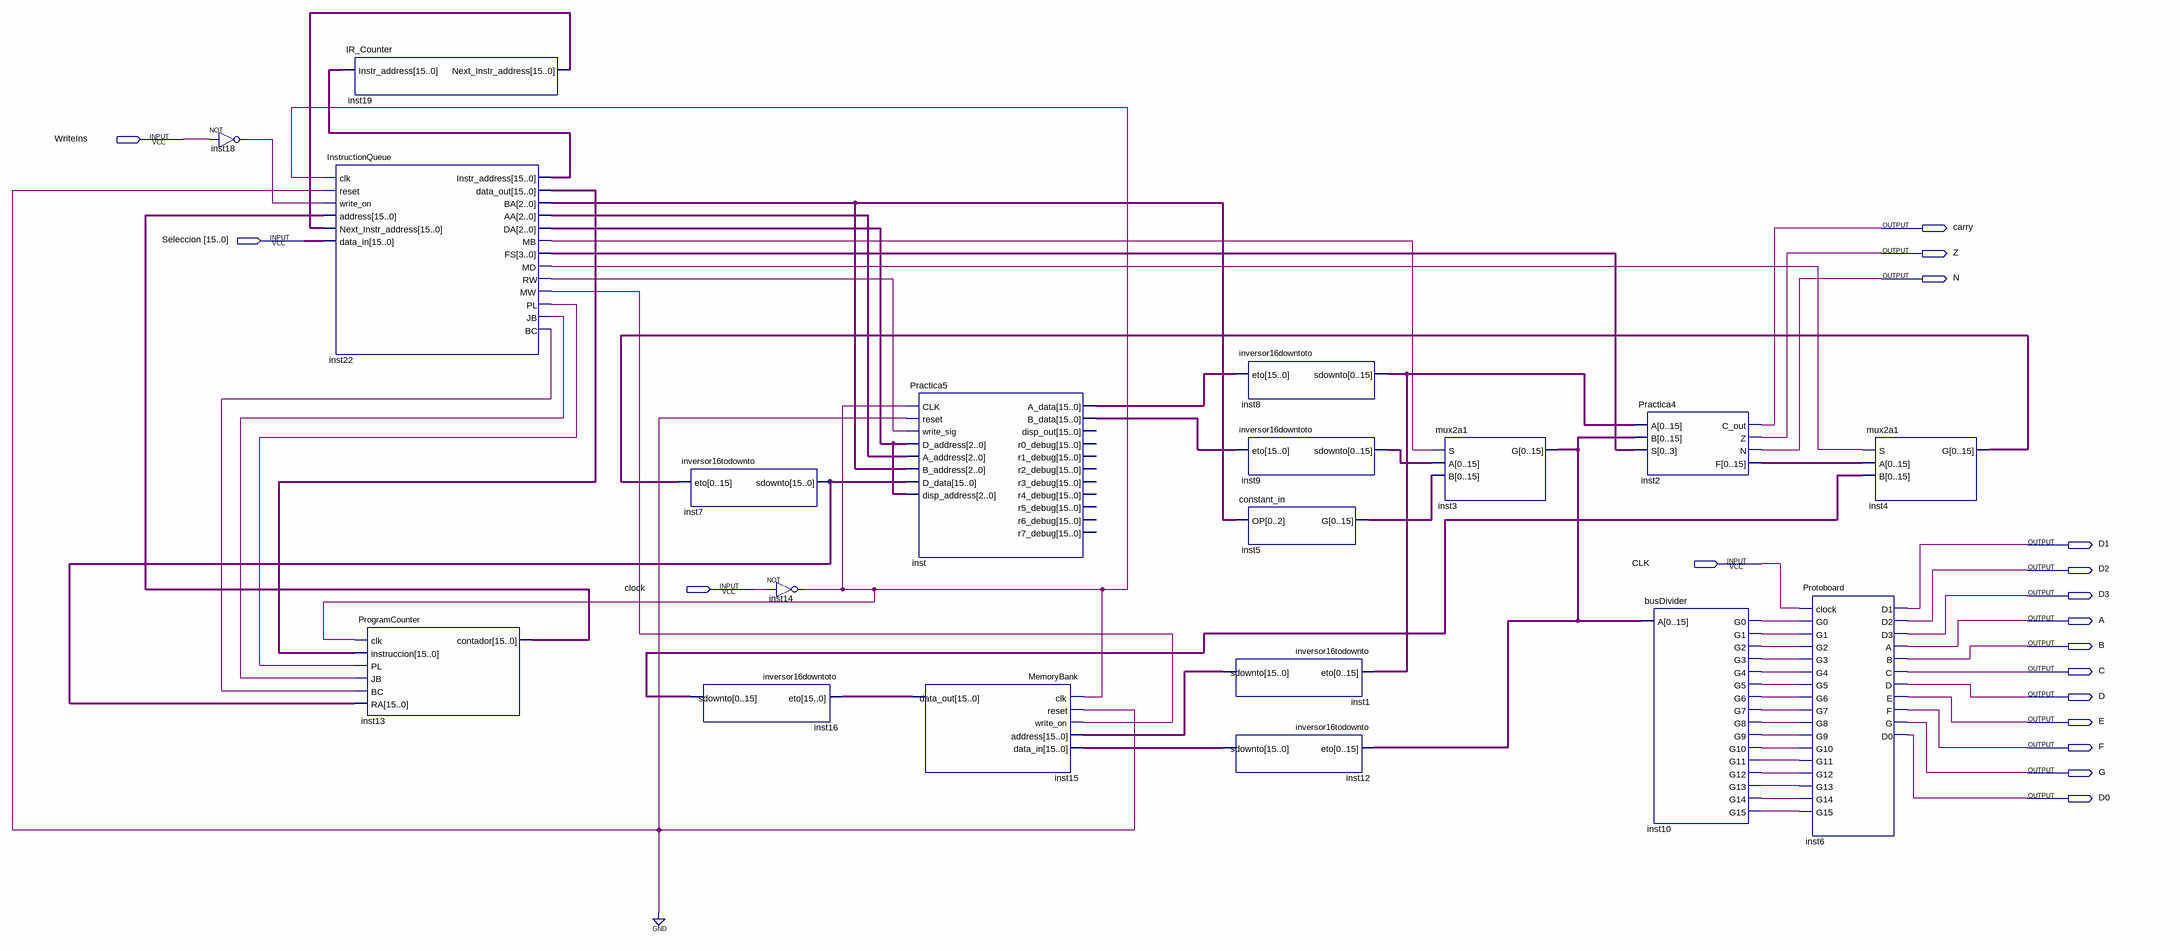
[diagram p0: schematic sheet]
// Quartus schematic CircuitoCompleto.bdf as structural Verilog: 19 symbols, 18 pins
module CircuitoCompleto (
  input  WriteIns,
  input  [15:0] Seleccion,
  input  CLK,
  input  clock,
  output carry,
  output Z,
  output N,
  output D1,
  output D2,
  output D3,
  output A,
  output B,
  output C,
  output D,
  output E,
  output F,
  output G,
  output D0
);

  wire inst10_g0, inst10_g1, inst10_g2, inst10_g3, inst10_g4, inst10_g5, inst10_g6, inst10_g7, inst10_g8,
       inst10_g9, inst10_g10, inst10_g11, inst10_g12, inst10_g13, inst10_g14, inst10_g15, inst14_out,
       inst18_out, inst22_bc, inst22_jb, inst22_mb, inst22_md, inst22_mw, inst22_pl, inst22_rw;
  wire [2:0] inst22_aa, inst22_ba, inst22_da;
  wire [3:0] inst22_fs;
  wire [15:0] inst1_sdownto, inst2_f, inst3_g, inst4_g, inst5_g, inst7_sdownto, inst8_sdownto, inst9_sdownto,
       inst12_sdownto, inst13_contador, inst15_data_out, inst16_sdownto, inst19_next_instr_address,
       inst22_data_out, inst22_instr_address, inst_a_data, inst_b_data;

  not inst18 (inst18_out, WriteIns);
  InstructionQueue inst22 (
    .clk(inst14_out), .reset(1'b0), .write_on(inst18_out), .address(inst13_contador),
    .Next_Instr_address(inst19_next_instr_address), .data_in(Seleccion),
    .Instr_address(inst22_instr_address), .data_out(inst22_data_out), .BA(inst22_ba), .AA(inst22_aa),
    .DA(inst22_da), .MB(inst22_mb), .FS(inst22_fs), .MD(inst22_md), .RW(inst22_rw), .MW(inst22_mw),
    .PL(inst22_pl), .JB(inst22_jb), .BC(inst22_bc));
  IR_Counter inst19 (.Instr_address(inst22_instr_address), .Next_Instr_address(inst19_next_instr_address));
  ProgramCounter inst13 (
    .clk(inst14_out), .instruccion(inst22_data_out), .PL(inst22_pl), .JB(inst22_jb), .BC(inst22_bc),
    .RA(inst7_sdownto), .contador(inst13_contador));
  inversor16todownto inst7 (.eto(inst4_g), .sdownto(inst7_sdownto));
  inversor16downtoto inst16 (.eto(inst15_data_out), .sdownto(inst16_sdownto));
  not inst14 (inst14_out, clock);
  Practica5 inst (
    .CLK(inst14_out), .reset(1'b0), .write_sig(inst22_rw), .D_address(inst22_da), .A_address(inst22_aa),
    .B_address(inst22_ba), .D_data(inst7_sdownto), .disp_address(inst22_da), .A_data(inst_a_data),
    .B_data(inst_b_data));  // open: disp_out, r0_debug, r1_debug, r2_debug, r3_debug, r4_debug, r5_debug, r6_debug, r7_debug
  MemoryBank inst15 (
    .clk(inst14_out), .reset(1'b0), .write_on(inst22_mw), .address(inst1_sdownto), .data_in(inst12_sdownto),
    .data_out(inst15_data_out));
  inversor16downtoto inst8 (.eto(inst_a_data), .sdownto(inst8_sdownto));
  inversor16downtoto inst9 (.eto(inst_b_data), .sdownto(inst9_sdownto));
  constant_in inst5 (.OP(inst22_ba), .G(inst5_g));
  inversor16todownto inst1 (.eto(inst8_sdownto), .sdownto(inst1_sdownto));
  inversor16todownto inst12 (.eto(inst3_g), .sdownto(inst12_sdownto));
  mux2a1 inst3 (.S(inst22_mb), .A(inst9_sdownto), .B(inst5_g), .G(inst3_g));
  Practica4 inst2 (.A(inst8_sdownto), .B(inst3_g), .S(inst22_fs), .C_out(carry), .Z(Z), .N(N), .F(inst2_f));
  busDivider inst10 (
    .A(inst3_g), .G0(inst10_g0), .G1(inst10_g1), .G2(inst10_g2), .G3(inst10_g3), .G4(inst10_g4),
    .G5(inst10_g5), .G6(inst10_g6), .G7(inst10_g7), .G8(inst10_g8), .G9(inst10_g9), .G10(inst10_g10),
    .G11(inst10_g11), .G12(inst10_g12), .G13(inst10_g13), .G14(inst10_g14), .G15(inst10_g15));
  Protoboard inst6 (
    .clock(CLK), .G0(inst10_g0), .G1(inst10_g1), .G2(inst10_g2), .G3(inst10_g3), .G4(inst10_g4),
    .G5(inst10_g5), .G6(inst10_g6), .G7(inst10_g7), .G8(inst10_g8), .G9(inst10_g9), .G10(inst10_g10),
    .G11(inst10_g11), .G12(inst10_g12), .G13(inst10_g13), .G14(inst10_g14), .G15(inst10_g15), .D1(D1),
    .D2(D2), .D3(D3), .A(A), .B(B), .C(C), .D(D), .E(E), .F(F), .G(G), .D0(D0));
  mux2a1 inst4 (.S(inst22_md), .A(inst2_f), .B(inst16_sdownto), .G(inst4_g));
endmodule
